# EAGLE design max7219 (EAGLE 9.2.1)
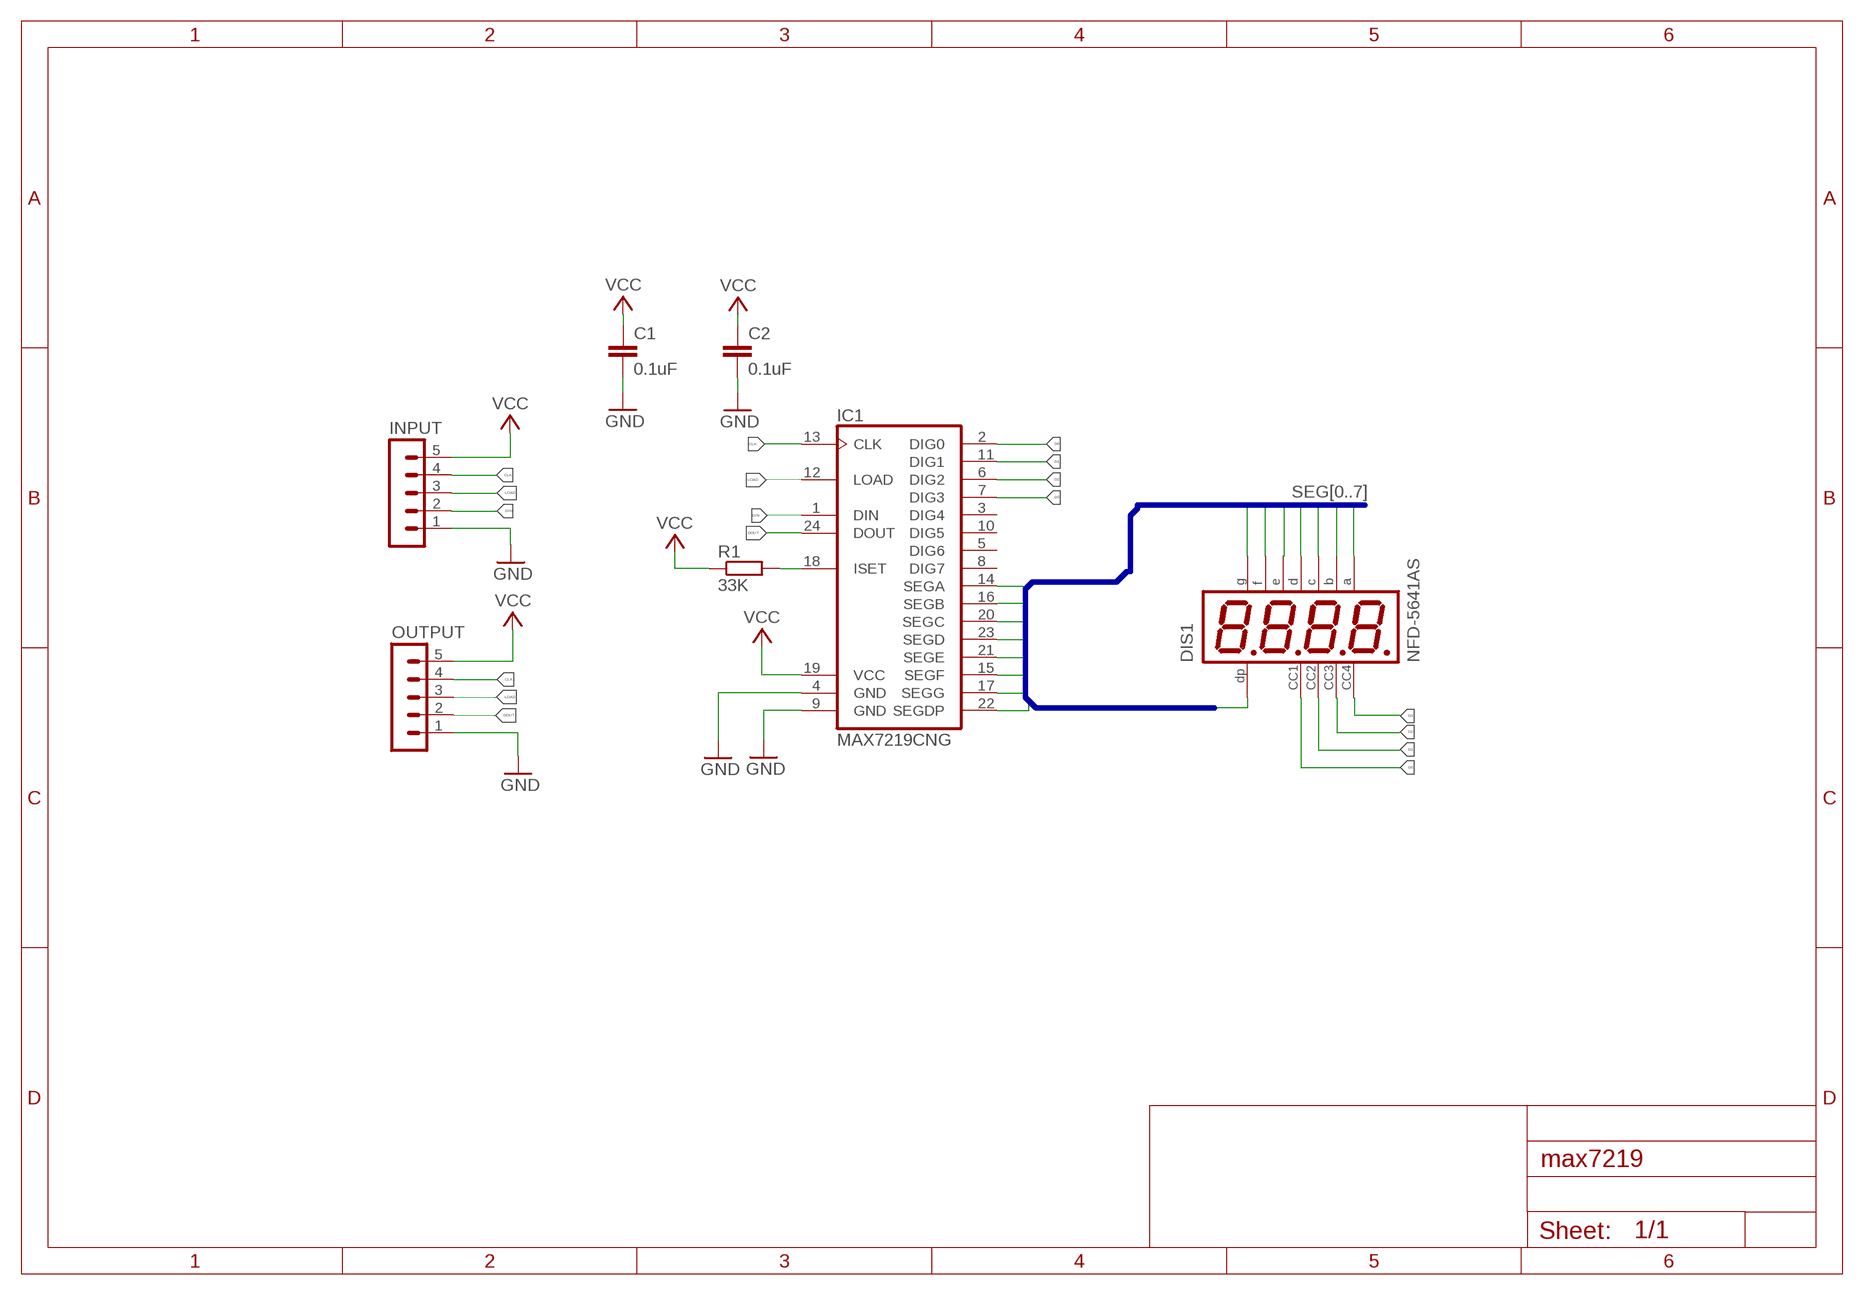
[diagram p0: schematic, sheet 1]

## Parts
C1  0.1uF  C-EU025-025X050  [C025-025X050]
C2  0.1uF  C-EU025-025X050  [C025-025X050]
DIS1  NFD-5641AS  [NFD-5641]
IC1  MAX7219CNG  [DIL24-3]
INPUT  MA05-1  [MA05-1]
OUTPUT  MA05-1  [MA05-1]
R1  33K  R-EU_0207/10  [0207/10]

## Nets
CLK: IC1.13(CLK) INPUT.4 OUTPUT.4
D0: DIS1.P$12 IC1.2(DIG0)
D1: DIS1.P$9 IC1.11(DIG1)
D2: DIS1.P$8 IC1.6(DIG2)
D3: DIS1.P$6 IC1.7(DIG3)
DIN: IC1.1(DIN) INPUT.2
DOUT: IC1.24(DOUT) OUTPUT.2
GND: C1.2 C2.2 IC1.4(GND) IC1.9(GND) INPUT.1 OUTPUT.1
LOAD: IC1.12(LOAD) INPUT.3 OUTPUT.3
N$1: IC1.18(ISET) R1.2
SEG0: DIS1.P$11 IC1.14(SEGA)
SEG1: DIS1.P$7 IC1.16(SEGB)
SEG2: DIS1.P$4 IC1.20(SEGC)
SEG3: DIS1.P$2 IC1.23(SEGD)
SEG4: DIS1.P$1 IC1.21(SEGE)
SEG5: DIS1.P$10 IC1.15(SEGF)
SEG6: DIS1.P$5 IC1.17(SEGG)
SEG7: DIS1.P$3 IC1.22(SEGDP)
VCC: C1.1 C2.1 IC1.19(VCC) INPUT.5 OUTPUT.5 R1.1
Unconnected: IC1.3(DIG4) IC1.5(DIG6) IC1.8(DIG7) IC1.10(DIG5)

## Buses
SEG[0..7]

## Library data of the parts
C1 C2 = rcl:C-EU: CAPACITOR, European symbol; SPICEPREFIX: C
DIS1 = display-nfd:NFD-5641AS: Four Digit 0.56" CC Seven-Segment LED Display Futurlec part number: 7FR5641AS Created by RobG
IC1 = maxim:MAX7219CNG: LED DISPLAY DRIVER; MF: MAXIM; MPN: MAX7219CNG; OC_FARNELL: 1523914; OC_NEWARK: 34C4018
INPUT OUTPUT = con-lstb:MA05-1: PIN HEADER; OC_FARNELL: unknown; OC_NEWARK: unknown
R1 = rcl:R-EU_: RESISTOR, European symbol; SPICEPREFIX: R

## Board
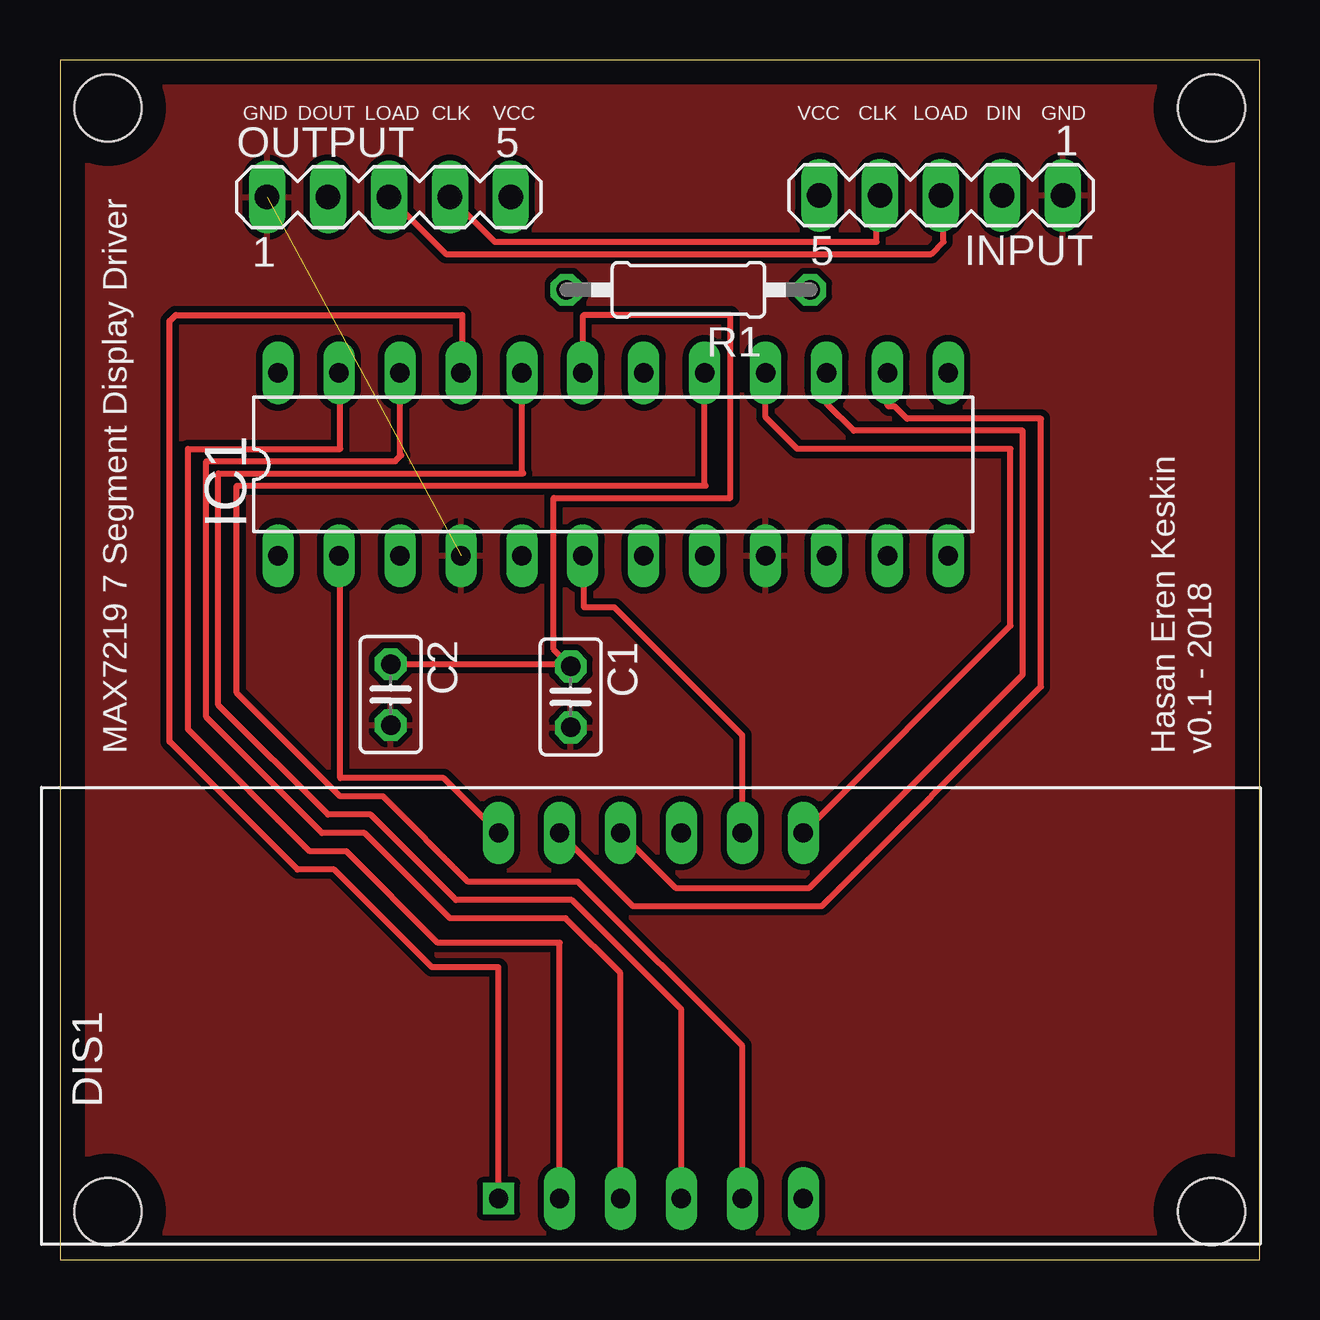
[diagram p1: board, top side]
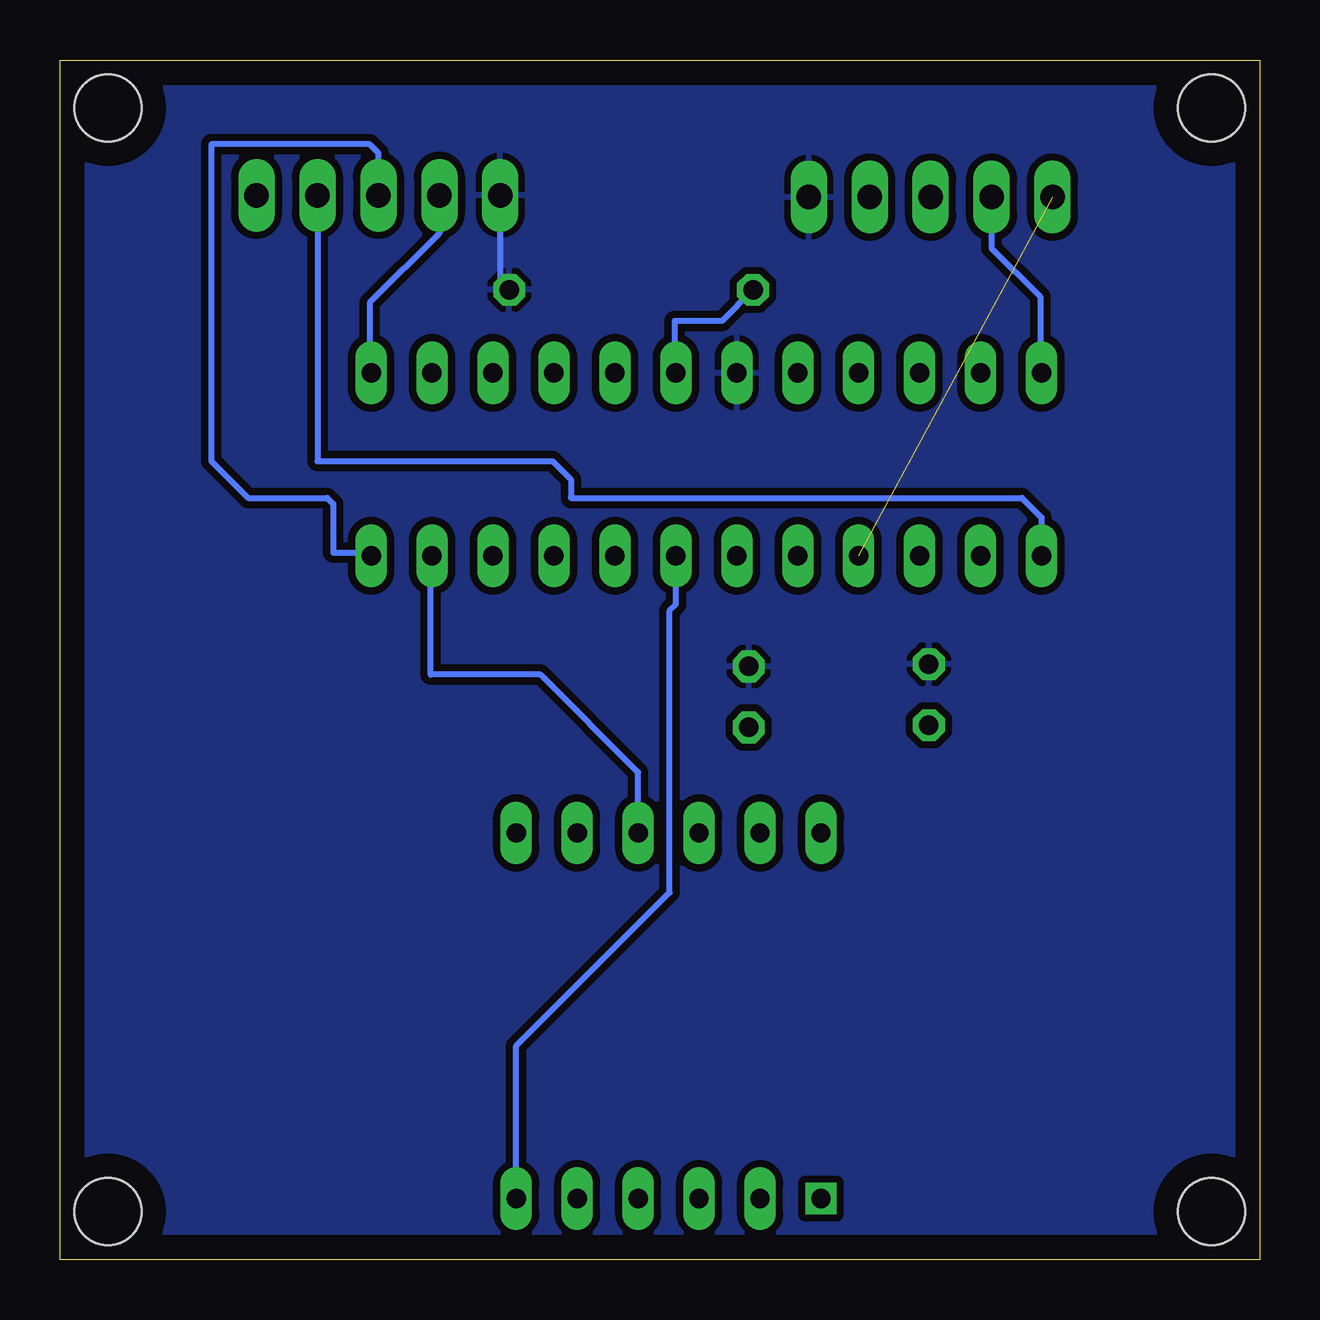
[diagram p2: board, bottom side, seen from below]

Size 50 x 50 mm. Coordinates in mm from the lower left corner, seen from the top.
Outline: 0,0 50,0 50,50 0,50 0,0
Copper layers (1*16): Top 0.035mm / dielectric 1.5mm / Bottom 0.035mm
Design rules "default *": minimum track width 10mil, minimum drill 24mil, track to track 6mil, track to pad 6mil, pad to pad 6mil, via to via 6mil, smd to smd 6mil, copper to edge 40mil, drill to drill 6mil, minimum pad ring 10mil, minimum via ring 8mil, stop-mask expansion 4mil, vias tented up to drill 0mil, thermal gap 10mil
Holes 2.8 mm at 48,2 2,2 48,48 2,48

### Footprints (pad centres in the part's own frame; a part is rotated, then mirrored left to right if it is on the bottom)
C025-025X050 = drill 0.813 octagon: 1 -1.27,0; 2 1.27,0
NFD-5641 = drill 0.8 square: P$1 -6.35,-7.62 | drill 0.8 long: P$2 -3.81,-7.62; P$3 -1.27,-7.62; P$4 1.27,-7.62; P$5 3.81,-7.62; P$6 6.35,-7.62; P$7 6.35,7.62; P$8 3.81,7.62; P$9 1.27,7.62; P$10 -1.27,7.62; P$11 -3.81,7.62; P$12 -6.35,7.62
DIL24-3 = drill 0.813 long: 1 -13.97,-3.81; 2 -11.43,-3.81; 3 -8.89,-3.81; 4 -6.35,-3.81; 5 -3.81,-3.81; 6 -1.27,-3.81; 7 1.27,-3.81; 8 3.81,-3.81; 9 6.35,-3.81; 10 8.89,-3.81; 11 11.43,-3.81; 12 13.97,-3.81; 13 13.97,3.81; 14 11.43,3.81; 15 8.89,3.81; 16 6.35,3.81; 17 3.81,3.81; 18 1.27,3.81; 19 -1.27,3.81; 20 -3.81,3.81; 21 -6.35,3.81; 22 -8.89,3.81; 23 -11.43,3.81; 24 -13.97,3.81
MA05-1 = drill 1.016 long: 1 -5.08,0; 2 -2.54,0; 3 0,0; 4 2.54,0; 5 5.08,0
0207/10 = drill 0.813 octagon: 1 -5.08,0; 2 5.08,0

### Placement (x,y rotation side)
C1  21.29,23.45 270 top
C2  13.78,23.55 270 top
DIS1  24.63,10.16 0 top
IC1  23.06,33.15 0 top
INPUT  36.73,44.36 180 top
OUTPUT  13.71,44.29 0 top
R1  26.19,40.42 180 top

### Tracks (layer width: path | path; a pad name or v marks a point on that pad's centre or on a via)
CLK
  Top 0.254: OUTPUT.4 18.12,42.42 34.04,42.42 34.04,44.21 INPUT.4
  Bottom 0.254: INPUT.4 34.19,42.78 37.08,39.88 37.08,37.01 IC1.13
D0
  Top 0.254: DIS1.P$12 15.99,20.07 11.68,20.07 11.68,29.28 IC1.2
D1
  Bottom 0.254: DIS1.P$9 25.9,20.31 29.97,24.38 34.54,24.38 34.54,29.28 IC1.11
D2
  Top 0.254: DIS1.P$8 28.44,21.85 23.11,27.18 21.84,27.18 21.84,29.28 IC1.6
D3
  Bottom 0.254: DIS1.P$6 30.98,8.9 24.58,15.29 24.58,27.05 24.33,27.3 IC1.7
DIN
  Bottom 0.254: INPUT.2 39.27,33.27 29.46,33.27 28.7,32.51 28.7,31.75 9.91,31.75 9.09,30.93 IC1.1
DOUT
  Bottom 0.254: OUTPUT.2 11.17,42.16 9.14,40.13 9.14,37.01 IC1.24
GND  (1 unrouted)
  pour Top (isolate 0.254): -0.26,50.04 50.29,50.04 50.29,-0.25 -0.51,-0.25
LOAD
  Top 0.254: OUTPUT.3 16.09,41.91 36.32,41.91 36.83,42.42 36.83,44.25 INPUT.3
  Bottom 0.254: INPUT.3 36.73,46.12 37.08,46.48 43.69,46.48 43.69,33.27 42.16,31.75 38.86,31.75 38.61,31.5 38.61,29.46 37.16,29.46 IC1.12
N$1
  Bottom 0.254: R1.2 22.41,39.12 24.38,39.12 24.38,37.01 IC1.18
SEG0
  Top 0.254: DIS1.P$11 23.87,14.73 31.75,14.73 40.89,23.88 40.89,35.05 35.31,35.05 34.8,35.56 34.54,35.56 34.49,35.61 IC1.14
SEG1
  Top 0.254: DIS1.P$7 39.62,26.42 39.62,33.78 30.73,33.78 29.41,35.11 IC1.16
SEG2
  Top 0.254: DIS1.P$4 25.9,10.42 21.34,14.99 16.51,14.99 12.95,18.54 11.18,18.54 6.6,23.11 6.6,32.77 19.3,32.77 19.25,32.82 IC1.20
SEG3
  Top 0.254: DIS1.P$2 20.82,13.2 20.83,13.21 15.75,13.21 11.94,17.02 10.41,17.02 5.33,22.1 5.33,33.78 11.68,33.78 11.68,36.9 IC1.23
SEG4
  Top 0.254: DIS1.P$1 18.28,12.18 15.5,12.18 11.43,16.26 9.91,16.26 4.57,21.59 4.57,39.12 4.83,39.37 16.76,39.37 16.76,37.01 IC1.21
SEG5
  Top 0.254: DIS1.P$10 25.65,15.49 31.24,15.49 40.13,24.38 40.13,34.54 33.09,34.54 31.95,35.69 IC1.15
SEG6
  Top 0.254: DIS1.P$5 28.44,8.9 21.59,15.75 17.02,15.75 13.46,19.3 11.68,19.3 7.37,23.62 7.37,32.26 26.92,32.26 26.87,32.31 IC1.17
SEG7
  Top 0.254: DIS1.P$3 23.36,11.95 21.08,14.22 16.26,14.22 12.7,17.78 10.92,17.78 6.1,22.61 6.1,33.27 13.97,33.27 14.22,33.53 14.17,33.58 IC1.22
VCC
  Top 0.254: C2.1 21.19,24.82 C1.1 20.57,25.44 20.57,31.75 27.94,31.75 27.94,39.37 21.84,39.37 21.79,39.32 IC1.19
  Bottom 0.254: INPUT.5 31.65,40.79 R1.1
  pour Bottom (isolate 0.305): 0,50.04 50.29,50.04 50.29,-0.25 -0.25,-0.25

### Text on the board
tNames: GND | DOUT | LOAD | CLK | VCC | VCC | CLK | LOAD | DIN | GND | MAX7219 7 Segment Display Driver | Hasan Eren Keskin / v0.1 - 2018